# Altium schematic sheet Ethernet.SchDoc
size 420 x 297 mm; Address1: Address1; Address2: Address2; Address3: Address3; Address4: Address4; DocumentNumber: *Э3; SheetNumber: 9; SheetTotal: 11; DocumentType: Схема электрическая *
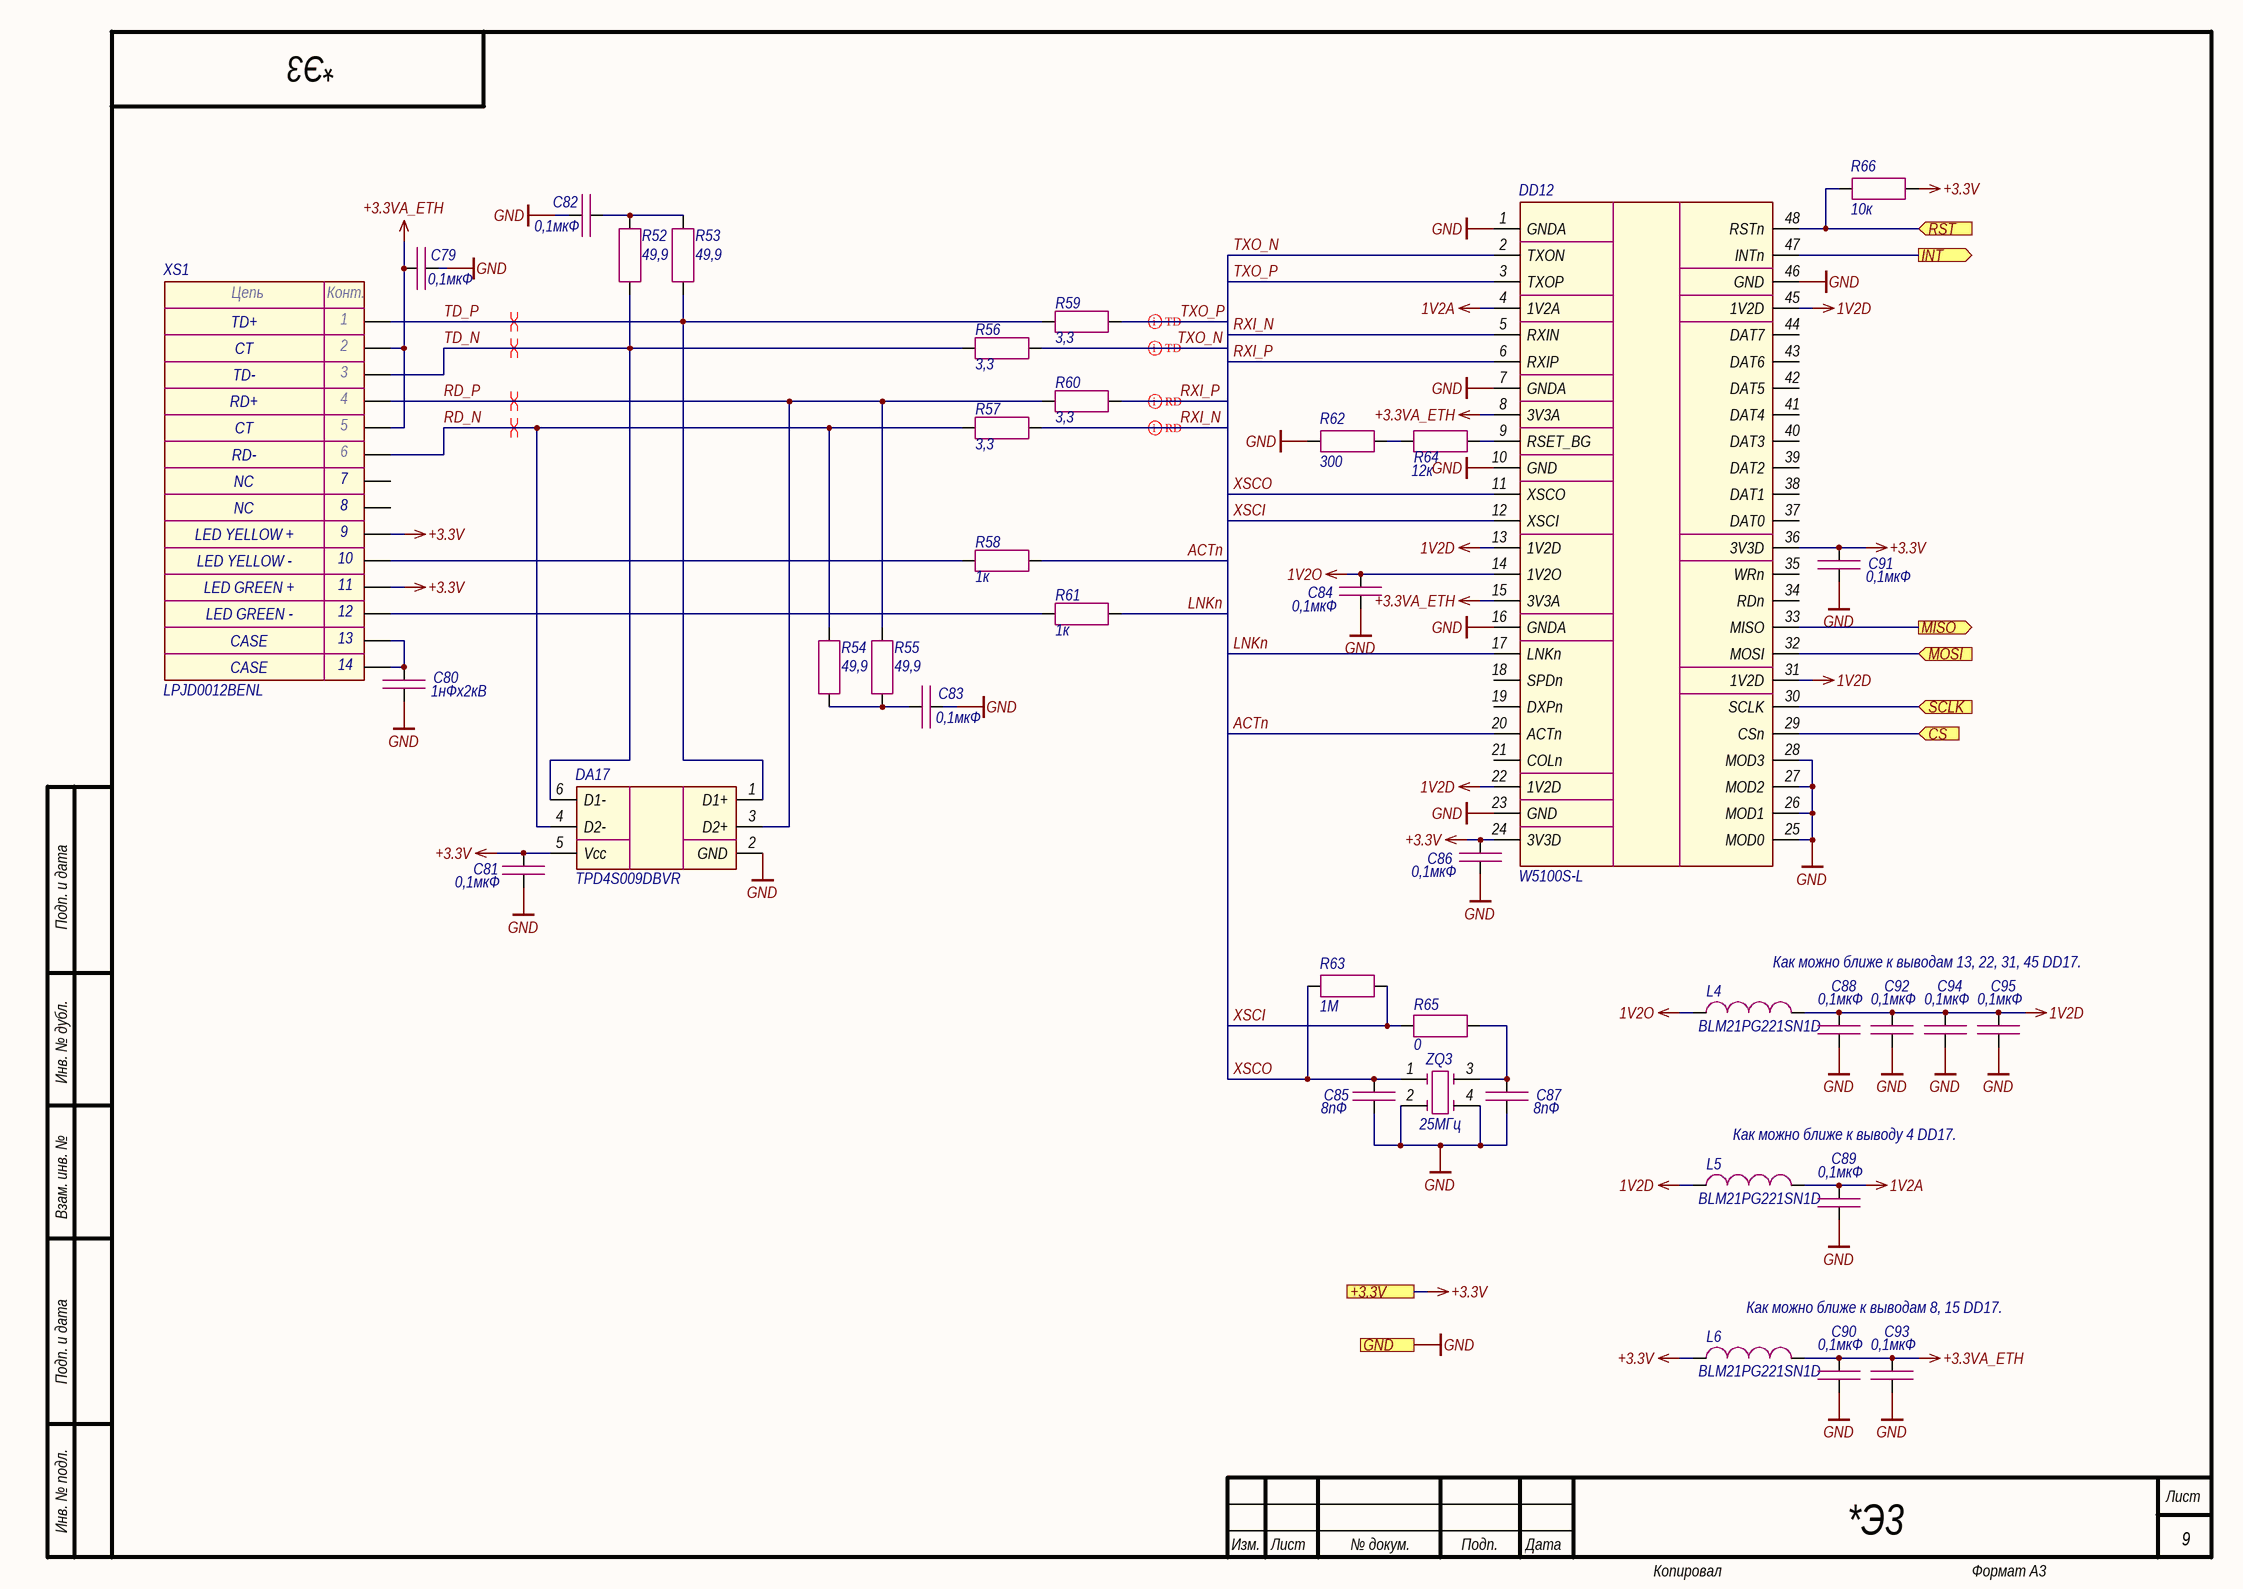
[diagram p0: Ethernet.SchDoc]

## Parts
C79  0,1мкФ  [CAP_0603]
C80  1нФх2кВ  [CAP_1206]
C81  0,1мкФ  [CAP_0603]
C82  0,1мкФ  [CAP_0603]
C83  0,1мкФ  [CAP_0603]
C84  0,1мкФ  [CAP_0603]
C85  8пФ  [CAP_0603]
C86  0,1мкФ  [CAP_0603]
C87  8пФ  [CAP_0603]
C88  0,1мкФ  [CAP_0603]
C89  0,1мкФ  [CAP_0603]
C90  0,1мкФ  [CAP_0603]
C91  0,1мкФ  [CAP_0603]
C92  0,1мкФ  [CAP_0603]
C93  0,1мкФ  [CAP_0603]
C94  0,1мкФ  [CAP_0603]
C95  0,1мкФ  [CAP_0603]
DA17  TPD4S009DBVR  [SOT-23-6]
DD12  W5100S-L  [LQFP-48]
L4  BLM21PG221SN1D  [IND_0805]
L5  BLM21PG221SN1D  [IND_0805]
L6  BLM21PG221SN1D  [IND_0805]
R52  49,9  [RES_0603]
R53  49,9  [RES_0603]
R54  49,9  [RES_0603]
R55  49,9  [RES_0603]
R56  3,3  [RES_0603]
R57  3,3  [RES_0603]
R58  1к  [RES_0603]
R59  3,3  [RES_0603]
R60  3,3  [RES_0603]
R61  1к  [RES_0603]
R62  300  [RES_0603]
R63  1М  [RES_0603]
R64  12к  [RES_0603]
R65  0  [RES_0603]
R66  10к  [RES_0603]
XS1  LPJD0012BENL  [LPJD0012BENL]
ZQ3  25МГц  [7M]

## Ports
+3.3V (see Main[3B], Fiber_interlock[2C], Flow_sensor[2C], Hardwiring[3D], LD_driver[1D], Power_supply[1D]), CS (in, see Main[2B]), GND (see Main[3B], Fiber_interlock[2C], Flow_sensor[2C], Guide_laser[1C], Hardwiring[3D], Indication[1C], LD_driver[1D], Power_supply[1D]), INT (out, see Main[3B]), MISO (out, see Main[2B]), MOSI (in, see Main[2B]), RST (in, see Main[3B]), SCLK (in, see Main[2B])

## Nets
1V2A: C89.1 DD12.4(1V2A) L5.2
1V2D: C88.1 C92.1 C94.1 C95.1 DD12.13(1V2D) DD12.22(1V2D) DD12.31(1V2D) DD12.45(1V2D) L4.2 L5.1
1V2O: C84.1 DD12.14(1V2O) L4.1
+3.3V: C81.1 C86.1 C91.1 DA17.5(Vcc) DD12.24(3V3D) DD12.36(3V3D) L6.1 R66.2 XS1.9 XS1.11 ; port +3.3V
+3.3VA_ETH: C79.1 C90.1 C93.1 DD12.8(3V3A) DD12.15(3V3A) L6.2 XS1.2 XS1.5
GND: C79.2 C80.2 C81.2 C82.2 C83.2 C84.2 C85.2 C86.2 C87.2 C88.2 C89.2 C90.2 C91.2 C92.2 C93.2 C94.2 C95.2 DA17.2(GND) DD12.1(GNDA) DD12.7(GNDA) DD12.10(GND) DD12.16(GNDA) DD12.23(GND) DD12.25(MOD0) DD12.26(MOD1) DD12.27(MOD2) DD12.28(MOD3) DD12.46(GND) R62.1 ZQ3.2 ZQ3.4 ; port GND
ACTn: DD12.20(ACTn) R58.2
CS: DD12.29(CSn) ; port CS
INT: DD12.47(INTn) ; port INT
LNKn: DD12.17(LNKn) R61.2
MISO: DD12.33(MISO) ; port MISO
MOSI: DD12.32(MOSI) ; port MOSI
RD_N: DA17.4(D2-) R54.1 R57.2 XS1.6
RD_P: DA17.3(D2+) R55.1 R60.2 XS1.4
RST: DD12.48(RSTn) R66.1 ; port RST
RXI_N: DD12.5(RXIN) R57.1
RXI_P: DD12.6(RXIP) R60.1
SCLK: DD12.30(SCLK) ; port SCLK
TD_N: DA17.6(D1-) R52.1 R56.2 XS1.3
TD_P: DA17.1(D1+) R53.1 R59.2 XS1.1
TXO_N: DD12.2(TXON) R56.1
TXO_P: DD12.3(TXOP) R59.1
XSCI: DD12.12(XSCI) R63.2 R65.1
XSCO: C85.1 DD12.11(XSCO) R63.1 ZQ3.1
NetC80_1: C80.1 XS1.13 XS1.14
NetC82_1: C82.1 R52.2 R53.2
NetC83_1: C83.1 R54.2 R55.2
NetC87_1: C87.1 R65.2 ZQ3.3
NetDD12_9: DD12.9(RSET_BG) R64.2
NetR58_1: R58.1 XS1.10
NetR61_1: R61.1 XS1.12
NetR62_2: R62.2 R64.1

Not connected (* = marked no-connect by the designer): DD12 18(SPDn) 19(DXPn) 21(COLn) 34(RDn) 35(WRn) 37(DAT0) 38(DAT1) 39(DAT2) 40(DAT3) 41(DAT4) 42(DAT5) 43(DAT6) 44(DAT7); XS1 7 8

## Layout directives
differential pair; differential pair class TD: TXO_N, TXO_P
differential pair; differential pair class RD: RXI_N, RXI_P
differential pair: RD_N, RD_P, TD_N, TD_P

## Notes on the sheet
- Как можно ближе к выводам 13, 22, 31, 45 DD17.
- Как можно ближе к выводу 4 DD17.
- Как можно ближе к выводам 8, 15 DD17.
- Подп. и дата
- Инв. № дубл.
- Взам. инв. №
- Инв. № подл.
- Изм.
- Лист
- № докум.
- Подп.
- Дата
- Копировал
- Формат А3
- (in symbol LPJD0012BENL) Цепь; Конт.; TD+; CT; TD-; RD+; RD-; NC; LED YELLOW +; LED YELLOW -; LED GREEN +; LED GREEN -; CASE

## Library data of the parts
C79 C81-C84 C86 C88-C95 = Capacitor: Manufacturer: Murata; Model: GRM188R71H104KA93D; Value: 0,1мкФ; Document: *
C80 = Capacitor: Manufacturer: Yageo; Model: CC1206KKX7RDBB102; Value: 1нФх2кВ; Document: *
C85 C87 = Capacitor: Manufacturer: Yageo; Model: CC0603CRNPO9BN8R0; Value: 8пФ; Document: *
DA17 = TPD4S009: Manufacturer: Texas Instruments; Model: TPD4S009DBVR; Document: *
DD12 = W5100S: Manufacturer: Wiznet; Model: W5100S-L; Document: *
L4-L6 = Inductor: Manufacturer: Murata; Value: *; Model: BLM21PG221SN1D; Document: *
R52-R55 = Resistor: Manufacturer: Yageo; Model: RC0603FR-0749R9L; Value: 49,9; Document: *
R56 R57 R59 R60 = Resistor: Manufacturer: Yageo; Model: RC0603FR-073R3L; Value: 3,3; Document: *
R58 R61 = Resistor: Manufacturer: Yageo; Model: RC0603FR-071KL; Value: 1к; Document: *
R62 = Resistor: Manufacturer: Yageo; Model: RC0603FR-07300RL; Value: 300; Document: *
R63 = Resistor: Manufacturer: Yageo; Model: RC0603FR-071ML; Value: 1М; Document: *
R64 = Resistor: Manufacturer: Yageo; Model: RC0603FR-0712KL; Value: 12к; Document: *
R65 = Resistor: Manufacturer: Yageo; Model: RC0603FR-070RL; Value: 0; Document: *
R66 = Resistor: Manufacturer: Yageo; Model: RC0603FR-0710KL; Value: 10к; Document: *
XS1 = LPJD0012BENL: Manufacturer: LINK-PP; Model: LPJD0012BENL; Document: *
ZQ3 = Quartz_Resonator_4-pin: Manufacturer: TXC; Model: 7M-25.000MAAJ-T; Value: 25МГц; Document: *